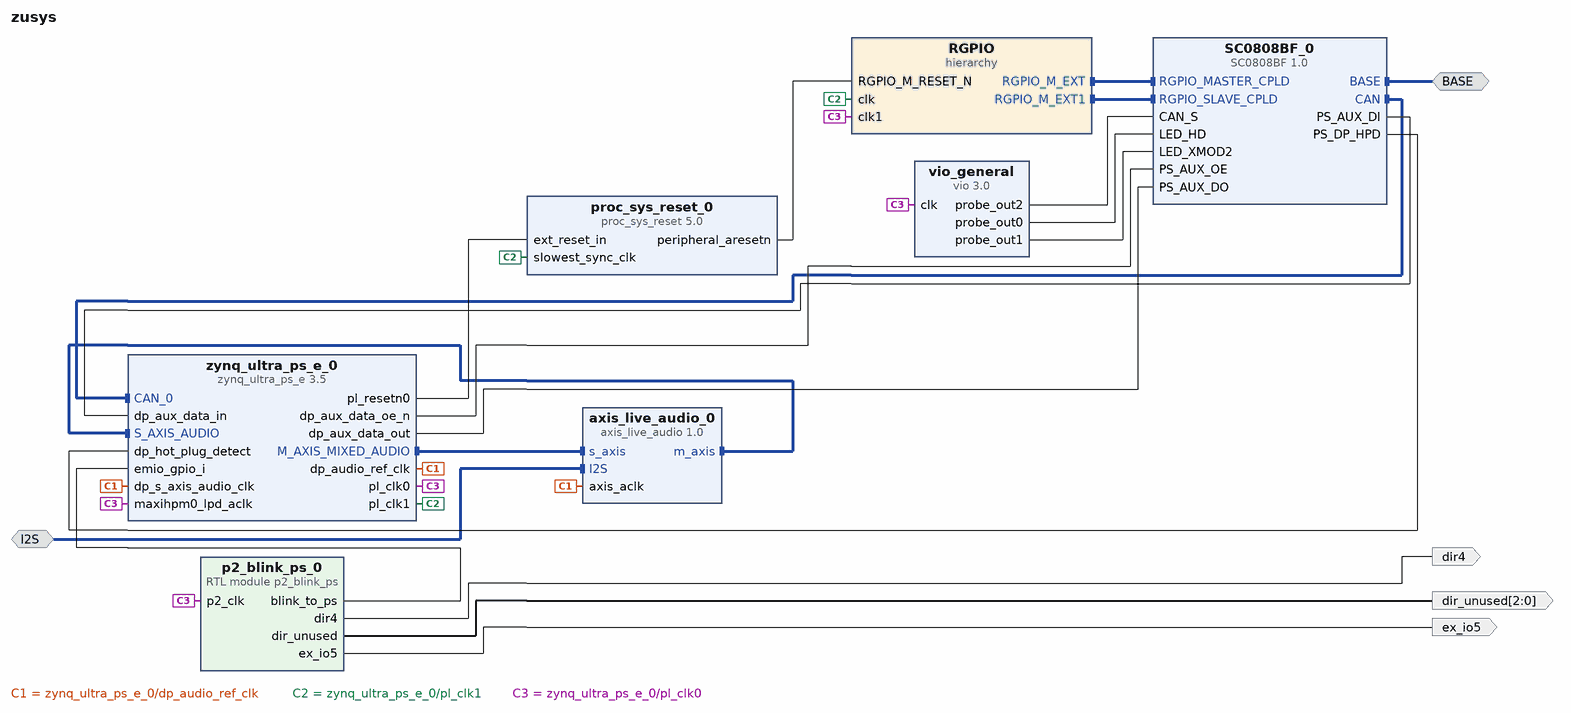
[diagram p0: block diagram of the top level]
# Vivado block design zusys, xczu3eg-sfvc784-1-e, Vivado 2024.2
create_bd_design zusys

create_bd_intf_port -mode Master -vlnv xilinx.com:user:SC0808BF_bus_rtl:1.0 BASE
create_bd_intf_port -mode Slave -vlnv trenz.biz:user:I2S_rtl:1.0 I2S
create_bd_port -dir O ex_io5
create_bd_port -dir O dir4
create_bd_port -dir O -from 2 -to 0 dir_unused

create_bd_cell -type hier RGPIO
create_bd_cell -type ip -vlnv trenz.biz:user:SC0808BF:1.0 SC0808BF_0
create_bd_cell -type ip -vlnv trenz.biz:user:axis_live_audio:1.0 axis_live_audio_0
create_bd_cell -type ip -vlnv xilinx.com:ip:proc_sys_reset:5.0 proc_sys_reset_0
create_bd_cell -type ip -vlnv xilinx.com:ip:vio:3.0 vio_general
set_property -dict {CONFIG.C_NUM_PROBE_IN 0 CONFIG.C_NUM_PROBE_OUT 3} [get_bd_cells vio_general]
create_bd_cell -type ip -vlnv xilinx.com:ip:zynq_ultra_ps_e:3.5 zynq_ultra_ps_e_0
set_property -dict [list \
  CONFIG.PSU_BANK_0_IO_STANDARD LVCMOS18 \
  CONFIG.PSU_BANK_1_IO_STANDARD LVCMOS18 \
  CONFIG.PSU_BANK_2_IO_STANDARD LVCMOS18 \
  CONFIG.PSU_BANK_3_IO_STANDARD LVCMOS18 \
  CONFIG.PSU_USB3__DUAL_CLOCK_ENABLE 1 \
  CONFIG.PSU__CAN0__PERIPHERAL__ENABLE 1 \
  CONFIG.PSU__CAN0__PERIPHERAL__IO EMIO \
  CONFIG.PSU__CRF_APB__DDR_CTRL__FREQMHZ 1200 \
  CONFIG.PSU__CRF_APB__DP_AUDIO_REF_CTRL__SRCSEL RPLL \
  CONFIG.PSU__CRF_APB__DP_STC_REF_CTRL__SRCSEL RPLL \
  CONFIG.PSU__CRF_APB__DP_VIDEO_REF_CTRL__SRCSEL VPLL \
  CONFIG.PSU__CRF_APB__TOPSW_MAIN_CTRL__SRCSEL APLL \
  CONFIG.PSU__CRL_APB__ADMA_REF_CTRL__SRCSEL IOPLL \
  CONFIG.PSU__CRL_APB__CPU_R5_CTRL__SRCSEL IOPLL \
  CONFIG.PSU__CRL_APB__IOU_SWITCH_CTRL__SRCSEL IOPLL \
  CONFIG.PSU__CRL_APB__LPD_SWITCH_CTRL__SRCSEL IOPLL \
  CONFIG.PSU__CRL_APB__PL0_REF_CTRL__SRCSEL IOPLL \
  CONFIG.PSU__CRL_APB__PL1_REF_CTRL__FREQMHZ 25 \
  CONFIG.PSU__CRL_APB__PL1_REF_CTRL__SRCSEL IOPLL \
  CONFIG.PSU__CRL_APB__SDIO0_REF_CTRL__SRCSEL IOPLL \
  CONFIG.PSU__CRL_APB__SDIO1_REF_CTRL__SRCSEL IOPLL \
  CONFIG.PSU__CRL_APB__USB3__ENABLE 1 \
  CONFIG.PSU__DDRC__DEVICE_CAPACITY {8192 MBits} \
  CONFIG.PSU__DDRC__DRAM_WIDTH {16 Bits} \
  CONFIG.PSU__DDRC__ECC Disabled \
  CONFIG.PSU__DDRC__SPEED_BIN DDR4_2400P \
  CONFIG.PSU__DDR_HIGH_ADDRESS_GUI_ENABLE 1 \
  CONFIG.PSU__DDR__INTERFACE__FREQMHZ 600.000 \
  CONFIG.PSU__DISPLAYPORT__LANE0__ENABLE 1 \
  CONFIG.PSU__DISPLAYPORT__LANE0__IO {GT Lane3} \
  CONFIG.PSU__DISPLAYPORT__LANE1__ENABLE 0 \
  CONFIG.PSU__DISPLAYPORT__PERIPHERAL__ENABLE 1 \
  CONFIG.PSU__DLL__ISUSED 1 \
  CONFIG.PSU__DPAUX__PERIPHERAL__ENABLE 1 \
  CONFIG.PSU__DPAUX__PERIPHERAL__IO EMIO \
  CONFIG.PSU__DP__LANE_SEL {Single Higher} \
  CONFIG.PSU__DP__REF_CLK_FREQ 27 \
  CONFIG.PSU__DP__REF_CLK_SEL {Ref Clk3} \
  CONFIG.PSU__ENET3__FIFO__ENABLE 0 \
  CONFIG.PSU__ENET3__GRP_MDIO__ENABLE 1 \
  CONFIG.PSU__ENET3__GRP_MDIO__IO {MIO 76 .. 77} \
  CONFIG.PSU__ENET3__PERIPHERAL__ENABLE 1 \
  CONFIG.PSU__ENET3__PERIPHERAL__IO {MIO 64 .. 75} \
  CONFIG.PSU__ENET3__PTP__ENABLE 0 \
  CONFIG.PSU__ENET3__TSU__ENABLE 0 \
  CONFIG.PSU__FPGA_PL1_ENABLE 1 \
  CONFIG.PSU__GEM3_COHERENCY 0 \
  CONFIG.PSU__GEM3_ROUTE_THROUGH_FPD 0 \
  CONFIG.PSU__GEM__TSU__ENABLE 0 \
  CONFIG.PSU__GPIO0_MIO__IO {MIO 0 .. 25} \
  CONFIG.PSU__GPIO0_MIO__PERIPHERAL__ENABLE 1 \
  CONFIG.PSU__GPIO_EMIO__PERIPHERAL__ENABLE 1 \
  CONFIG.PSU__GPIO_EMIO__PERIPHERAL__IO 1 \
  CONFIG.PSU__GT__LINK_SPEED HBR \
  CONFIG.PSU__GT__PRE_EMPH_LVL_4 0 \
  CONFIG.PSU__GT__VLT_SWNG_LVL_4 0 \
  CONFIG.PSU__I2C0__PERIPHERAL__ENABLE 1 \
  CONFIG.PSU__I2C0__PERIPHERAL__IO {MIO 38 .. 39} \
  CONFIG.PSU__PCIE__BAR0_VAL 0x0 \
  CONFIG.PSU__PCIE__BAR1_VAL 0x0 \
  CONFIG.PSU__PCIE__BAR2_VAL 0x0 \
  CONFIG.PSU__PCIE__BAR3_VAL 0x0 \
  CONFIG.PSU__PCIE__BAR4_VAL 0x0 \
  CONFIG.PSU__PCIE__BAR5_VAL 0x0 \
  CONFIG.PSU__PCIE__CLASS_CODE_BASE 0x06 \
  CONFIG.PSU__PCIE__CLASS_CODE_INTERFACE 0x0 \
  CONFIG.PSU__PCIE__CLASS_CODE_SUB 0x04 \
  CONFIG.PSU__PCIE__CLASS_CODE_VALUE 0x60400 \
  CONFIG.PSU__PCIE__DEVICE_ID 0xD021 \
  CONFIG.PSU__PCIE__DEVICE_PORT_TYPE {Root Port} \
  CONFIG.PSU__PCIE__EROM_VAL 0x0 \
  CONFIG.PSU__PCIE__LANE0__ENABLE 1 \
  CONFIG.PSU__PCIE__LANE0__IO {GT Lane0} \
  CONFIG.PSU__PCIE__LINK_SPEED {5.0 Gb/s} \
  CONFIG.PSU__PCIE__MAXIMUM_LINK_WIDTH x1 \
  CONFIG.PSU__PCIE__MAX_PAYLOAD_SIZE {256 bytes} \
  CONFIG.PSU__PCIE__PERIPHERAL__ENABLE 1 \
  CONFIG.PSU__PCIE__PERIPHERAL__ENDPOINT_ENABLE 0 \
  CONFIG.PSU__PCIE__PERIPHERAL__ROOTPORT_ENABLE 1 \
  CONFIG.PSU__PCIE__PERIPHERAL__ROOTPORT_IO {MIO 31} \
  CONFIG.PSU__PCIE__REF_CLK_FREQ 100 \
  CONFIG.PSU__PCIE__REF_CLK_SEL {Ref Clk2} \
  CONFIG.PSU__PCIE__REVISION_ID 0x0 \
  CONFIG.PSU__PCIE__SUBSYSTEM_ID 0x7 \
  CONFIG.PSU__PCIE__SUBSYSTEM_VENDOR_ID 0x10EE \
  CONFIG.PSU__PCIE__VENDOR_ID 0x10EE \
  CONFIG.PSU__PJTAG__PERIPHERAL__ENABLE 1 \
  CONFIG.PSU__PJTAG__PERIPHERAL__IO {MIO 26 .. 29} \
  CONFIG.PSU__PRESET_APPLIED 1 \
  CONFIG.PSU__PSS_REF_CLK__FREQMHZ 33.333333 \
  CONFIG.PSU__QSPI_COHERENCY 0 \
  CONFIG.PSU__QSPI_ROUTE_THROUGH_FPD 0 \
  CONFIG.PSU__QSPI__GRP_FBCLK__ENABLE 1 \
  CONFIG.PSU__QSPI__GRP_FBCLK__IO {MIO 6} \
  CONFIG.PSU__QSPI__PERIPHERAL__DATA_MODE x4 \
  CONFIG.PSU__QSPI__PERIPHERAL__ENABLE 1 \
  CONFIG.PSU__QSPI__PERIPHERAL__IO {MIO 0 .. 12} \
  CONFIG.PSU__QSPI__PERIPHERAL__MODE {Dual Parallel} \
  CONFIG.PSU__SATA__LANE0__ENABLE 1 \
  CONFIG.PSU__SATA__LANE0__IO {GT Lane2} \
  CONFIG.PSU__SATA__LANE1__ENABLE 0 \
  CONFIG.PSU__SATA__PERIPHERAL__ENABLE 1 \
  CONFIG.PSU__SATA__REF_CLK_FREQ 150 \
  CONFIG.PSU__SATA__REF_CLK_SEL {Ref Clk1} \
  CONFIG.PSU__SD0__CLK_200_SDR_OTAP_DLY 0x3 \
  CONFIG.PSU__SD0__CLK_50_DDR_ITAP_DLY 0x12 \
  CONFIG.PSU__SD0__CLK_50_DDR_OTAP_DLY 0x6 \
  CONFIG.PSU__SD0__CLK_50_SDR_ITAP_DLY 0x15 \
  CONFIG.PSU__SD0__CLK_50_SDR_OTAP_DLY 0x6 \
  CONFIG.PSU__SD0__DATA_TRANSFER_MODE 8Bit \
  CONFIG.PSU__SD0__GRP_POW__ENABLE 1 \
  CONFIG.PSU__SD0__GRP_POW__IO {MIO 23} \
  CONFIG.PSU__SD0__PERIPHERAL__ENABLE 1 \
  CONFIG.PSU__SD0__PERIPHERAL__IO {MIO 13 .. 22} \
  CONFIG.PSU__SD0__RESET__ENABLE 1 \
  CONFIG.PSU__SD0__SLOT_TYPE eMMC \
  CONFIG.PSU__SD1_COHERENCY 0 \
  CONFIG.PSU__SD1_ROUTE_THROUGH_FPD 0 \
  CONFIG.PSU__SD1__CLK_50_SDR_ITAP_DLY 0x15 \
  CONFIG.PSU__SD1__CLK_50_SDR_OTAP_DLY 0x5 \
  CONFIG.PSU__SD1__DATA_TRANSFER_MODE 4Bit \
  CONFIG.PSU__SD1__GRP_CD__ENABLE 1 \
  CONFIG.PSU__SD1__GRP_CD__IO {MIO 45} \
  CONFIG.PSU__SD1__GRP_POW__ENABLE 0 \
  CONFIG.PSU__SD1__GRP_WP__ENABLE 1 \
  CONFIG.PSU__SD1__GRP_WP__IO {MIO 44} \
  CONFIG.PSU__SD1__PERIPHERAL__ENABLE 1 \
  CONFIG.PSU__SD1__PERIPHERAL__IO {MIO 46 .. 51} \
  CONFIG.PSU__SD1__SLOT_TYPE {SD 2.0} \
  CONFIG.PSU__SWDT0__CLOCK__ENABLE 0 \
  CONFIG.PSU__SWDT0__PERIPHERAL__ENABLE 1 \
  CONFIG.PSU__SWDT0__RESET__ENABLE 0 \
  CONFIG.PSU__SWDT1__CLOCK__ENABLE 0 \
  CONFIG.PSU__SWDT1__PERIPHERAL__ENABLE 1 \
  CONFIG.PSU__SWDT1__RESET__ENABLE 0 \
  CONFIG.PSU__TSU__BUFG_PORT_PAIR 0 \
  CONFIG.PSU__TTC0__CLOCK__ENABLE 0 \
  CONFIG.PSU__TTC0__PERIPHERAL__ENABLE 1 \
  CONFIG.PSU__TTC0__WAVEOUT__ENABLE 0 \
  CONFIG.PSU__TTC1__CLOCK__ENABLE 0 \
  CONFIG.PSU__TTC1__PERIPHERAL__ENABLE 1 \
  CONFIG.PSU__TTC1__WAVEOUT__ENABLE 0 \
  CONFIG.PSU__TTC2__CLOCK__ENABLE 0 \
  CONFIG.PSU__TTC2__PERIPHERAL__ENABLE 1 \
  CONFIG.PSU__TTC2__WAVEOUT__ENABLE 0 \
  CONFIG.PSU__TTC3__CLOCK__ENABLE 0 \
  CONFIG.PSU__TTC3__PERIPHERAL__ENABLE 1 \
  CONFIG.PSU__TTC3__WAVEOUT__ENABLE 0 \
  CONFIG.PSU__UART0__BAUD_RATE 115200 \
  CONFIG.PSU__UART0__MODEM__ENABLE 0 \
  CONFIG.PSU__UART0__PERIPHERAL__ENABLE 1 \
  CONFIG.PSU__UART0__PERIPHERAL__IO {MIO 42 .. 43} \
  CONFIG.PSU__USB0_COHERENCY 0 \
  CONFIG.PSU__USB0__PERIPHERAL__ENABLE 1 \
  CONFIG.PSU__USB0__PERIPHERAL__IO {MIO 52 .. 63} \
  CONFIG.PSU__USB0__REF_CLK_FREQ 100 \
  CONFIG.PSU__USB0__REF_CLK_SEL {Ref Clk2} \
  CONFIG.PSU__USB0__RESET__ENABLE 1 \
  CONFIG.PSU__USB0__RESET__IO {MIO 30} \
  CONFIG.PSU__USB2_0__EMIO__ENABLE 0 \
  CONFIG.PSU__USB3_0__EMIO__ENABLE 0 \
  CONFIG.PSU__USB3_0__PERIPHERAL__ENABLE 1 \
  CONFIG.PSU__USB3_0__PERIPHERAL__IO {GT Lane1} \
  CONFIG.PSU__USB__RESET__MODE {Separate MIO Pin} \
  CONFIG.PSU__USB__RESET__POLARITY {Active Low} \
  CONFIG.PSU__USE__AUDIO 1 \
] [get_bd_cells zynq_ultra_ps_e_0]
# 101 more settings of zynq_ultra_ps_e_0 are not shown: defaults, MIO pin electricals, DDR timing, and values the tool derives
create_bd_cell -type module -reference p2_blink_ps p2_blink_ps_0

# ---- hierarchy /RGPIO ----
current_bd_instance /RGPIO
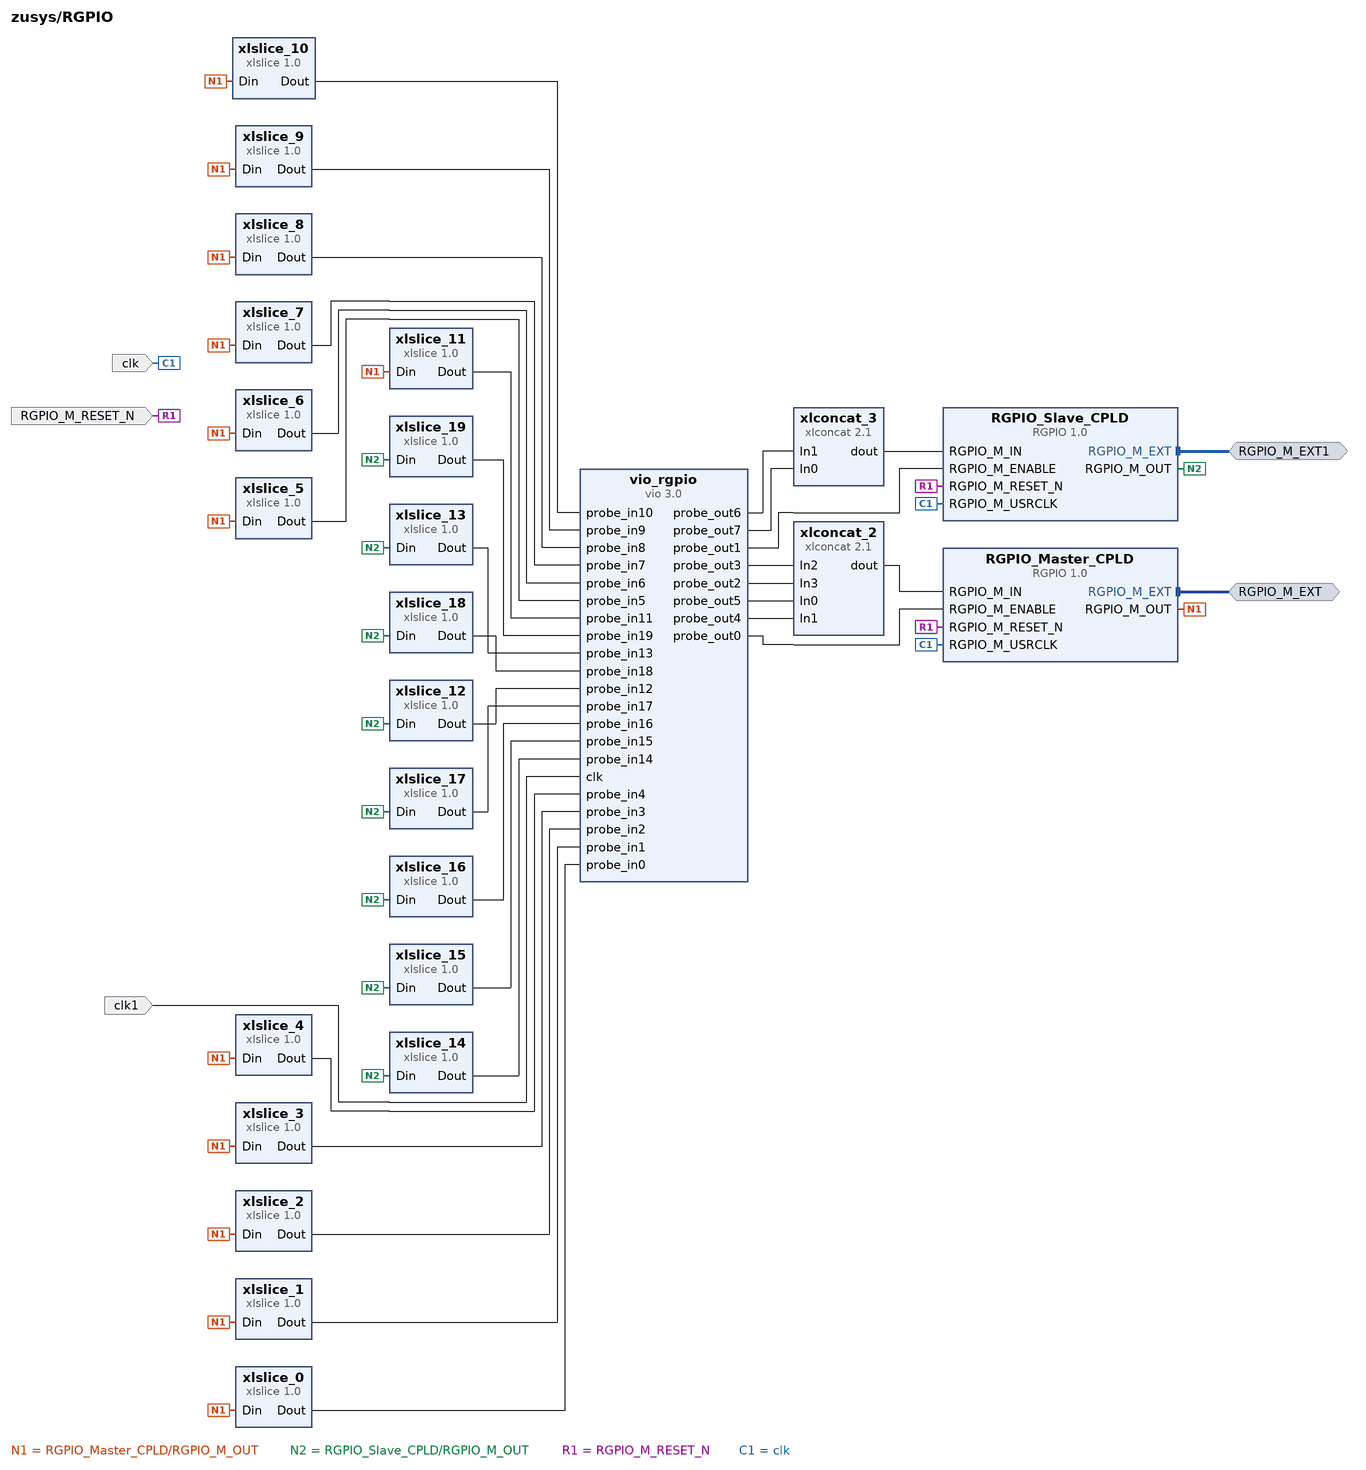
[diagram p1: block diagram inside /RGPIO]
create_bd_intf_pin -mode Master -vlnv trenz.biz:user:RGPIO_EXT_rtl:1.0 RGPIO_M_EXT
create_bd_intf_pin -mode Master -vlnv trenz.biz:user:RGPIO_EXT_rtl:1.0 RGPIO_M_EXT1
create_bd_pin -dir I -type rst RGPIO_M_RESET_N
create_bd_pin -dir I -type clk clk
create_bd_pin -dir I -type clk clk1

create_bd_cell -type ip -vlnv trenz.biz:user:RGPIO:1.0 RGPIO_Master_CPLD
set_property -dict {CONFIG.C_TYP 0} [get_bd_cells RGPIO_Master_CPLD]
create_bd_cell -type ip -vlnv trenz.biz:user:RGPIO:1.0 RGPIO_Slave_CPLD
set_property -dict {CONFIG.C_TYP 0} [get_bd_cells RGPIO_Slave_CPLD]
create_bd_cell -type ip -vlnv xilinx.com:ip:vio:3.0 vio_rgpio
set_property -dict [list \
  CONFIG.C_NUM_PROBE_IN 20 \
  CONFIG.C_NUM_PROBE_OUT 8 \
  CONFIG.C_PROBE_OUT0_WIDTH 1 \
  CONFIG.C_PROBE_OUT1_WIDTH 1 \
  CONFIG.C_PROBE_OUT2_WIDTH 12 \
  CONFIG.C_PROBE_OUT3_WIDTH 4 \
  CONFIG.C_PROBE_OUT4_WIDTH 2 \
  CONFIG.C_PROBE_OUT5_WIDTH 6 \
  CONFIG.C_PROBE_OUT6_WIDTH 16 \
  CONFIG.C_PROBE_OUT7_WIDTH 8 \
] [get_bd_cells vio_rgpio]
create_bd_cell -type ip -vlnv xilinx.com:ip:xlconcat:2.1 xlconcat_2
set_property -dict {CONFIG.NUM_PORTS 4} [get_bd_cells xlconcat_2]
create_bd_cell -type ip -vlnv xilinx.com:ip:xlconcat:2.1 xlconcat_3
create_bd_cell -type ip -vlnv xilinx.com:ip:xlslice:1.0 xlslice_0
set_property -dict {CONFIG.DIN_FROM 23 CONFIG.DIN_TO 23 CONFIG.DIN_WIDTH 24 CONFIG.DOUT_WIDTH 1} [get_bd_cells xlslice_0]
create_bd_cell -type ip -vlnv xilinx.com:ip:xlslice:1.0 xlslice_1
set_property -dict {CONFIG.DIN_FROM 22 CONFIG.DIN_TO 22 CONFIG.DIN_WIDTH 24 CONFIG.DOUT_WIDTH 1} [get_bd_cells xlslice_1]
create_bd_cell -type ip -vlnv xilinx.com:ip:xlslice:1.0 xlslice_2
set_property -dict {CONFIG.DIN_FROM 21 CONFIG.DIN_TO 21 CONFIG.DIN_WIDTH 24 CONFIG.DOUT_WIDTH 1} [get_bd_cells xlslice_2]
create_bd_cell -type ip -vlnv xilinx.com:ip:xlslice:1.0 xlslice_3
set_property -dict {CONFIG.DIN_FROM 20 CONFIG.DIN_TO 20 CONFIG.DIN_WIDTH 24 CONFIG.DOUT_WIDTH 1} [get_bd_cells xlslice_3]
create_bd_cell -type ip -vlnv xilinx.com:ip:xlslice:1.0 xlslice_4
set_property -dict {CONFIG.DIN_FROM 19 CONFIG.DIN_TO 19 CONFIG.DIN_WIDTH 24 CONFIG.DOUT_WIDTH 1} [get_bd_cells xlslice_4]
create_bd_cell -type ip -vlnv xilinx.com:ip:xlslice:1.0 xlslice_5
set_property -dict {CONFIG.DIN_FROM 18 CONFIG.DIN_TO 18 CONFIG.DIN_WIDTH 24 CONFIG.DOUT_WIDTH 1} [get_bd_cells xlslice_5]
create_bd_cell -type ip -vlnv xilinx.com:ip:xlslice:1.0 xlslice_6
set_property -dict {CONFIG.DIN_FROM 17 CONFIG.DIN_TO 17 CONFIG.DIN_WIDTH 24 CONFIG.DOUT_WIDTH 1} [get_bd_cells xlslice_6]
create_bd_cell -type ip -vlnv xilinx.com:ip:xlslice:1.0 xlslice_7
set_property -dict {CONFIG.DIN_FROM 16 CONFIG.DIN_TO 16 CONFIG.DIN_WIDTH 24 CONFIG.DOUT_WIDTH 1} [get_bd_cells xlslice_7]
create_bd_cell -type ip -vlnv xilinx.com:ip:xlslice:1.0 xlslice_8
set_property -dict {CONFIG.DIN_FROM 15 CONFIG.DIN_TO 13 CONFIG.DIN_WIDTH 24 CONFIG.DOUT_WIDTH 3} [get_bd_cells xlslice_8]
create_bd_cell -type ip -vlnv xilinx.com:ip:xlslice:1.0 xlslice_9
set_property -dict {CONFIG.DIN_FROM 12 CONFIG.DIN_TO 12 CONFIG.DIN_WIDTH 24 CONFIG.DOUT_WIDTH 1} [get_bd_cells xlslice_9]
create_bd_cell -type ip -vlnv xilinx.com:ip:xlslice:1.0 xlslice_10
set_property -dict {CONFIG.DIN_FROM 11 CONFIG.DIN_TO 8 CONFIG.DIN_WIDTH 24 CONFIG.DOUT_WIDTH 4} [get_bd_cells xlslice_10]
create_bd_cell -type ip -vlnv xilinx.com:ip:xlslice:1.0 xlslice_11
set_property -dict {CONFIG.DIN_FROM 7 CONFIG.DIN_TO 0 CONFIG.DIN_WIDTH 24 CONFIG.DOUT_WIDTH 8} [get_bd_cells xlslice_11]
create_bd_cell -type ip -vlnv xilinx.com:ip:xlslice:1.0 xlslice_12
set_property -dict {CONFIG.DIN_FROM 23 CONFIG.DIN_TO 12 CONFIG.DIN_WIDTH 24 CONFIG.DOUT_WIDTH 12} [get_bd_cells xlslice_12]
create_bd_cell -type ip -vlnv xilinx.com:ip:xlslice:1.0 xlslice_13
set_property -dict {CONFIG.DIN_FROM 11 CONFIG.DIN_TO 8 CONFIG.DIN_WIDTH 24 CONFIG.DOUT_WIDTH 4} [get_bd_cells xlslice_13]
create_bd_cell -type ip -vlnv xilinx.com:ip:xlslice:1.0 xlslice_14
set_property -dict {CONFIG.DIN_FROM 7 CONFIG.DIN_TO 6 CONFIG.DIN_WIDTH 24 CONFIG.DOUT_WIDTH 2} [get_bd_cells xlslice_14]
create_bd_cell -type ip -vlnv xilinx.com:ip:xlslice:1.0 xlslice_15
set_property -dict {CONFIG.DIN_FROM 5 CONFIG.DIN_TO 4 CONFIG.DIN_WIDTH 24 CONFIG.DOUT_WIDTH 2} [get_bd_cells xlslice_15]
create_bd_cell -type ip -vlnv xilinx.com:ip:xlslice:1.0 xlslice_16
set_property -dict {CONFIG.DIN_FROM 3 CONFIG.DIN_TO 3 CONFIG.DIN_WIDTH 24 CONFIG.DOUT_WIDTH 1} [get_bd_cells xlslice_16]
create_bd_cell -type ip -vlnv xilinx.com:ip:xlslice:1.0 xlslice_17
set_property -dict {CONFIG.DIN_FROM 2 CONFIG.DIN_TO 2 CONFIG.DIN_WIDTH 24 CONFIG.DOUT_WIDTH 1} [get_bd_cells xlslice_17]
create_bd_cell -type ip -vlnv xilinx.com:ip:xlslice:1.0 xlslice_18
set_property -dict {CONFIG.DIN_FROM 1 CONFIG.DIN_TO 1 CONFIG.DIN_WIDTH 24 CONFIG.DOUT_WIDTH 1} [get_bd_cells xlslice_18]
create_bd_cell -type ip -vlnv xilinx.com:ip:xlslice:1.0 xlslice_19
set_property -dict {CONFIG.DIN_FROM 0 CONFIG.DIN_TO 0 CONFIG.DIN_WIDTH 24 CONFIG.DOUT_WIDTH 1} [get_bd_cells xlslice_19]

# ---- connections ----

current_bd_instance /RGPIO
connect_bd_intf_net [get_bd_intf_pins RGPIO_M_EXT] [get_bd_intf_pins RGPIO_Master_CPLD/RGPIO_M_EXT]
connect_bd_intf_net [get_bd_intf_pins RGPIO_M_EXT1] [get_bd_intf_pins RGPIO_Slave_CPLD/RGPIO_M_EXT]
connect_bd_net [get_bd_pins RGPIO_Master_CPLD/RGPIO_M_OUT] \
  [get_bd_pins xlslice_0/Din] [get_bd_pins xlslice_1/Din] [get_bd_pins xlslice_10/Din] [get_bd_pins xlslice_11/Din] \
  [get_bd_pins xlslice_2/Din] [get_bd_pins xlslice_3/Din] [get_bd_pins xlslice_4/Din] [get_bd_pins xlslice_5/Din] \
  [get_bd_pins xlslice_6/Din] [get_bd_pins xlslice_7/Din] [get_bd_pins xlslice_8/Din] [get_bd_pins xlslice_9/Din]
connect_bd_net [get_bd_pins RGPIO_Slave_CPLD/RGPIO_M_OUT] \
  [get_bd_pins xlslice_12/Din] [get_bd_pins xlslice_13/Din] [get_bd_pins xlslice_14/Din] [get_bd_pins xlslice_15/Din] \
  [get_bd_pins xlslice_16/Din] [get_bd_pins xlslice_17/Din] [get_bd_pins xlslice_18/Din] [get_bd_pins xlslice_19/Din]
connect_bd_net -net clk1_1 [get_bd_pins clk1] [get_bd_pins vio_rgpio/clk]
connect_bd_net -net proc_sys_reset_0_peripheral_aresetn [get_bd_pins RGPIO_M_RESET_N] \
  [get_bd_pins RGPIO_Master_CPLD/RGPIO_M_RESET_N] [get_bd_pins RGPIO_Slave_CPLD/RGPIO_M_RESET_N]
connect_bd_net -net vio_rgpio_m_11dt8_MUX [get_bd_pins xlslice_10/Dout] [get_bd_pins vio_rgpio/probe_in10]
connect_bd_net -net vio_rgpio_m_11dt8_muxsel [get_bd_pins vio_rgpio/probe_out3] [get_bd_pins xlconcat_2/In2]
connect_bd_net -net vio_rgpio_m_12_CAN_FAULT [get_bd_pins xlslice_9/Dout] [get_bd_pins vio_rgpio/probe_in9]
connect_bd_net -net vio_rgpio_m_15dt13_PHY_LEDS [get_bd_pins xlslice_8/Dout] [get_bd_pins vio_rgpio/probe_in8]
connect_bd_net -net vio_rgpio_m_16_XMOD2BUTTON [get_bd_pins xlslice_7/Dout] [get_bd_pins vio_rgpio/probe_in7]
connect_bd_net -net vio_rgpio_m_17_S5_3_USER [get_bd_pins xlslice_6/Dout] [get_bd_pins vio_rgpio/probe_in6]
connect_bd_net -net vio_rgpio_m_18_S5_4_FMCVADJ [get_bd_pins xlslice_5/Dout] [get_bd_pins vio_rgpio/probe_in5]
connect_bd_net -net vio_rgpio_m_19_reserved [get_bd_pins xlslice_4/Dout] [get_bd_pins vio_rgpio/probe_in4]
connect_bd_net -net vio_rgpio_m_20_SD_WP [get_bd_pins xlslice_3/Dout] [get_bd_pins vio_rgpio/probe_in3]
connect_bd_net -net vio_rgpio_m_21_FMC_CLKDIR [get_bd_pins xlslice_2/Dout] [get_bd_pins vio_rgpio/probe_in2]
connect_bd_net -net vio_rgpio_m_22_PJTAG_TRST [get_bd_pins xlslice_1/Dout] [get_bd_pins vio_rgpio/probe_in1]
connect_bd_net -net vio_rgpio_m_23_PJTAG_SRST [get_bd_pins xlslice_0/Dout] [get_bd_pins vio_rgpio/probe_in0]
connect_bd_net -net vio_rgpio_m_23dt12_unused [get_bd_pins vio_rgpio/probe_out2] [get_bd_pins xlconcat_2/In3]
connect_bd_net -net vio_rgpio_m_5dt0_leds [get_bd_pins vio_rgpio/probe_out5] [get_bd_pins xlconcat_2/In0]
connect_bd_net -net vio_rgpio_m_7dt0_data [get_bd_pins xlslice_11/Dout] [get_bd_pins vio_rgpio/probe_in11]
connect_bd_net -net vio_rgpio_m_7dt6_unused [get_bd_pins vio_rgpio/probe_out4] [get_bd_pins xlconcat_2/In1]
connect_bd_net -net vio_rgpio_m_enable [get_bd_pins vio_rgpio/probe_out0] [get_bd_pins RGPIO_Master_CPLD/RGPIO_M_ENABLE]
connect_bd_net -net vio_rgpio_s_0_S5_1_bootmode [get_bd_pins xlslice_19/Dout] [get_bd_pins vio_rgpio/probe_in19]
connect_bd_net -net vio_rgpio_s_11dt8_bootmode [get_bd_pins xlslice_13/Dout] [get_bd_pins vio_rgpio/probe_in13]
connect_bd_net -net vio_rgpio_s_1_S5_2_bootmode [get_bd_pins xlslice_18/Dout] [get_bd_pins vio_rgpio/probe_in18]
connect_bd_net -net vio_rgpio_s_23dt12_PG [get_bd_pins xlslice_12/Dout] [get_bd_pins vio_rgpio/probe_in12]
connect_bd_net -net vio_rgpio_s_23dt8_unused [get_bd_pins vio_rgpio/probe_out6] [get_bd_pins xlconcat_3/In1]
connect_bd_net -net vio_rgpio_s_2_xmod1_button [get_bd_pins xlslice_17/Dout] [get_bd_pins vio_rgpio/probe_in17]
connect_bd_net -net vio_rgpio_s_3_unused [get_bd_pins xlslice_16/Dout] [get_bd_pins vio_rgpio/probe_in16]
connect_bd_net -net vio_rgpio_s_6dt5_SD_CD [get_bd_pins xlslice_15/Dout] [get_bd_pins vio_rgpio/probe_in15]
connect_bd_net -net vio_rgpio_s_7dt0_data [get_bd_pins vio_rgpio/probe_out7] [get_bd_pins xlconcat_3/In0]
connect_bd_net -net vio_rgpio_s_7dt6_ER_ERST [get_bd_pins xlslice_14/Dout] [get_bd_pins vio_rgpio/probe_in14]
connect_bd_net -net vio_rgpio_s_enable [get_bd_pins vio_rgpio/probe_out1] [get_bd_pins RGPIO_Slave_CPLD/RGPIO_M_ENABLE]
connect_bd_net [get_bd_pins xlconcat_2/dout] [get_bd_pins RGPIO_Master_CPLD/RGPIO_M_IN]
connect_bd_net [get_bd_pins xlconcat_3/dout] [get_bd_pins RGPIO_Slave_CPLD/RGPIO_M_IN]
connect_bd_net -net zynq_ultra_ps_e_0_pl_clk0 [get_bd_pins clk] \
  [get_bd_pins RGPIO_Master_CPLD/RGPIO_M_USRCLK] [get_bd_pins RGPIO_Slave_CPLD/RGPIO_M_USRCLK]

current_bd_instance /
connect_bd_intf_net -intf_net I2S_0_1 [get_bd_intf_ports I2S] [get_bd_intf_pins axis_live_audio_0/I2S]
connect_bd_intf_net -intf_net RGPIO_Master_CPLD_RGPIO_M_EXT [get_bd_intf_pins RGPIO/RGPIO_M_EXT] [get_bd_intf_pins SC0808BF_0/RGPIO_MASTER_CPLD]
connect_bd_intf_net -intf_net RGPIO_Slave_CPLD_RGPIO_M_EXT [get_bd_intf_pins RGPIO/RGPIO_M_EXT1] [get_bd_intf_pins SC0808BF_0/RGPIO_SLAVE_CPLD]
connect_bd_intf_net [get_bd_intf_ports BASE] [get_bd_intf_pins SC0808BF_0/BASE]
connect_bd_intf_net [get_bd_intf_pins axis_live_audio_0/m_axis] [get_bd_intf_pins zynq_ultra_ps_e_0/S_AXIS_AUDIO]
connect_bd_intf_net [get_bd_intf_pins SC0808BF_0/CAN] [get_bd_intf_pins zynq_ultra_ps_e_0/CAN_0]
connect_bd_intf_net [get_bd_intf_pins axis_live_audio_0/s_axis] [get_bd_intf_pins zynq_ultra_ps_e_0/M_AXIS_MIXED_AUDIO]
connect_bd_net [get_bd_pins SC0808BF_0/PS_AUX_DI] [get_bd_pins zynq_ultra_ps_e_0/dp_aux_data_in]
connect_bd_net [get_bd_pins SC0808BF_0/PS_DP_HPD] [get_bd_pins zynq_ultra_ps_e_0/dp_hot_plug_detect]
connect_bd_net [get_bd_pins p2_blink_ps_0/blink_to_ps] [get_bd_pins zynq_ultra_ps_e_0/emio_gpio_i]
connect_bd_net [get_bd_pins p2_blink_ps_0/dir4] [get_bd_ports dir4]
connect_bd_net [get_bd_pins p2_blink_ps_0/dir_unused] [get_bd_ports dir_unused]
connect_bd_net [get_bd_pins p2_blink_ps_0/ex_io5] [get_bd_ports ex_io5]
connect_bd_net [get_bd_pins proc_sys_reset_0/peripheral_aresetn] [get_bd_pins RGPIO/RGPIO_M_RESET_N]
connect_bd_net -net vio_CAN_0_S [get_bd_pins vio_general/probe_out2] [get_bd_pins SC0808BF_0/CAN_S]
connect_bd_net -net vio_LED_HD [get_bd_pins vio_general/probe_out0] [get_bd_pins SC0808BF_0/LED_HD]
connect_bd_net -net vio_LED_XMOD2 [get_bd_pins vio_general/probe_out1] [get_bd_pins SC0808BF_0/LED_XMOD2]
connect_bd_net [get_bd_pins zynq_ultra_ps_e_0/dp_audio_ref_clk] \
  [get_bd_pins axis_live_audio_0/axis_aclk] [get_bd_pins zynq_ultra_ps_e_0/dp_s_axis_audio_clk]
connect_bd_net [get_bd_pins zynq_ultra_ps_e_0/dp_aux_data_oe_n] [get_bd_pins SC0808BF_0/PS_AUX_OE]
connect_bd_net [get_bd_pins zynq_ultra_ps_e_0/dp_aux_data_out] [get_bd_pins SC0808BF_0/PS_AUX_DO]
connect_bd_net [get_bd_pins zynq_ultra_ps_e_0/pl_clk1] [get_bd_pins RGPIO/clk] [get_bd_pins proc_sys_reset_0/slowest_sync_clk]
connect_bd_net [get_bd_pins zynq_ultra_ps_e_0/pl_clk0] \
  [get_bd_pins RGPIO/clk1] [get_bd_pins vio_general/clk] [get_bd_pins zynq_ultra_ps_e_0/maxihpm0_lpd_aclk] \
  [get_bd_pins p2_blink_ps_0/p2_clk]
connect_bd_net [get_bd_pins zynq_ultra_ps_e_0/pl_resetn0] [get_bd_pins proc_sys_reset_0/ext_reset_in]

set_property USER_COMMENTS.comment_0 {Important TEBF0808 CPLD Update to REV07 is needed to use this RGPIO definition!!!} [current_bd_design]
set_property USER_COMMENTS.comment_2 {Important TEBF0808 CPLD Update to REV07 is needed to use this RGPIO definition!!!} [current_bd_design]

validate_bd_design
save_bd_design
